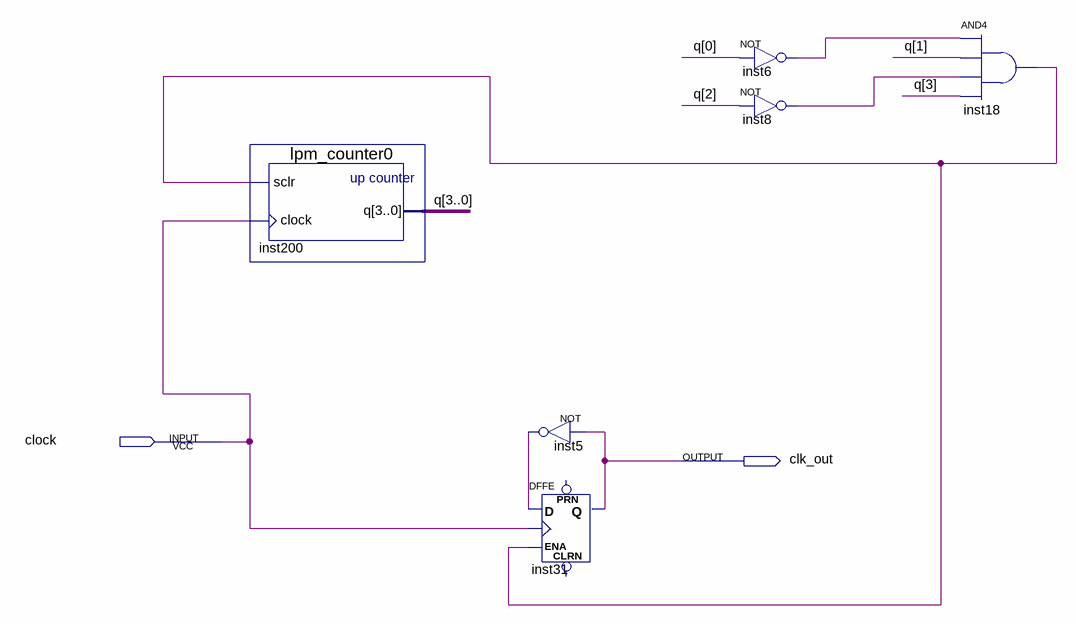
[diagram p0: schematic sheet]
// Quartus schematic stopwatch.bdf as structural Verilog: 6 symbols, 2 pins
module stopwatch (
  input  clock,
  output clk_out
);

  wire inst5_out, inst6_out, inst8_out, inst18_out;
  wire [3:0] q;

  lpm_counter0 inst200 (.sclr(inst18_out), .clock(clock), .q(q));
  not inst5 (inst5_out, clk_out);
  DFFE inst31 (.D(inst5_out), .CLK(clock), .ENA(inst18_out), .Q(clk_out));  // open: PRN, CLRN
  not inst6 (inst6_out, q[0]);
  not inst8 (inst8_out, q[2]);
  and inst18 (inst18_out, inst6_out, q[1], inst8_out, q[3]);
endmodule
